# EAGLE design Homematic (EAGLE 7.7.0)
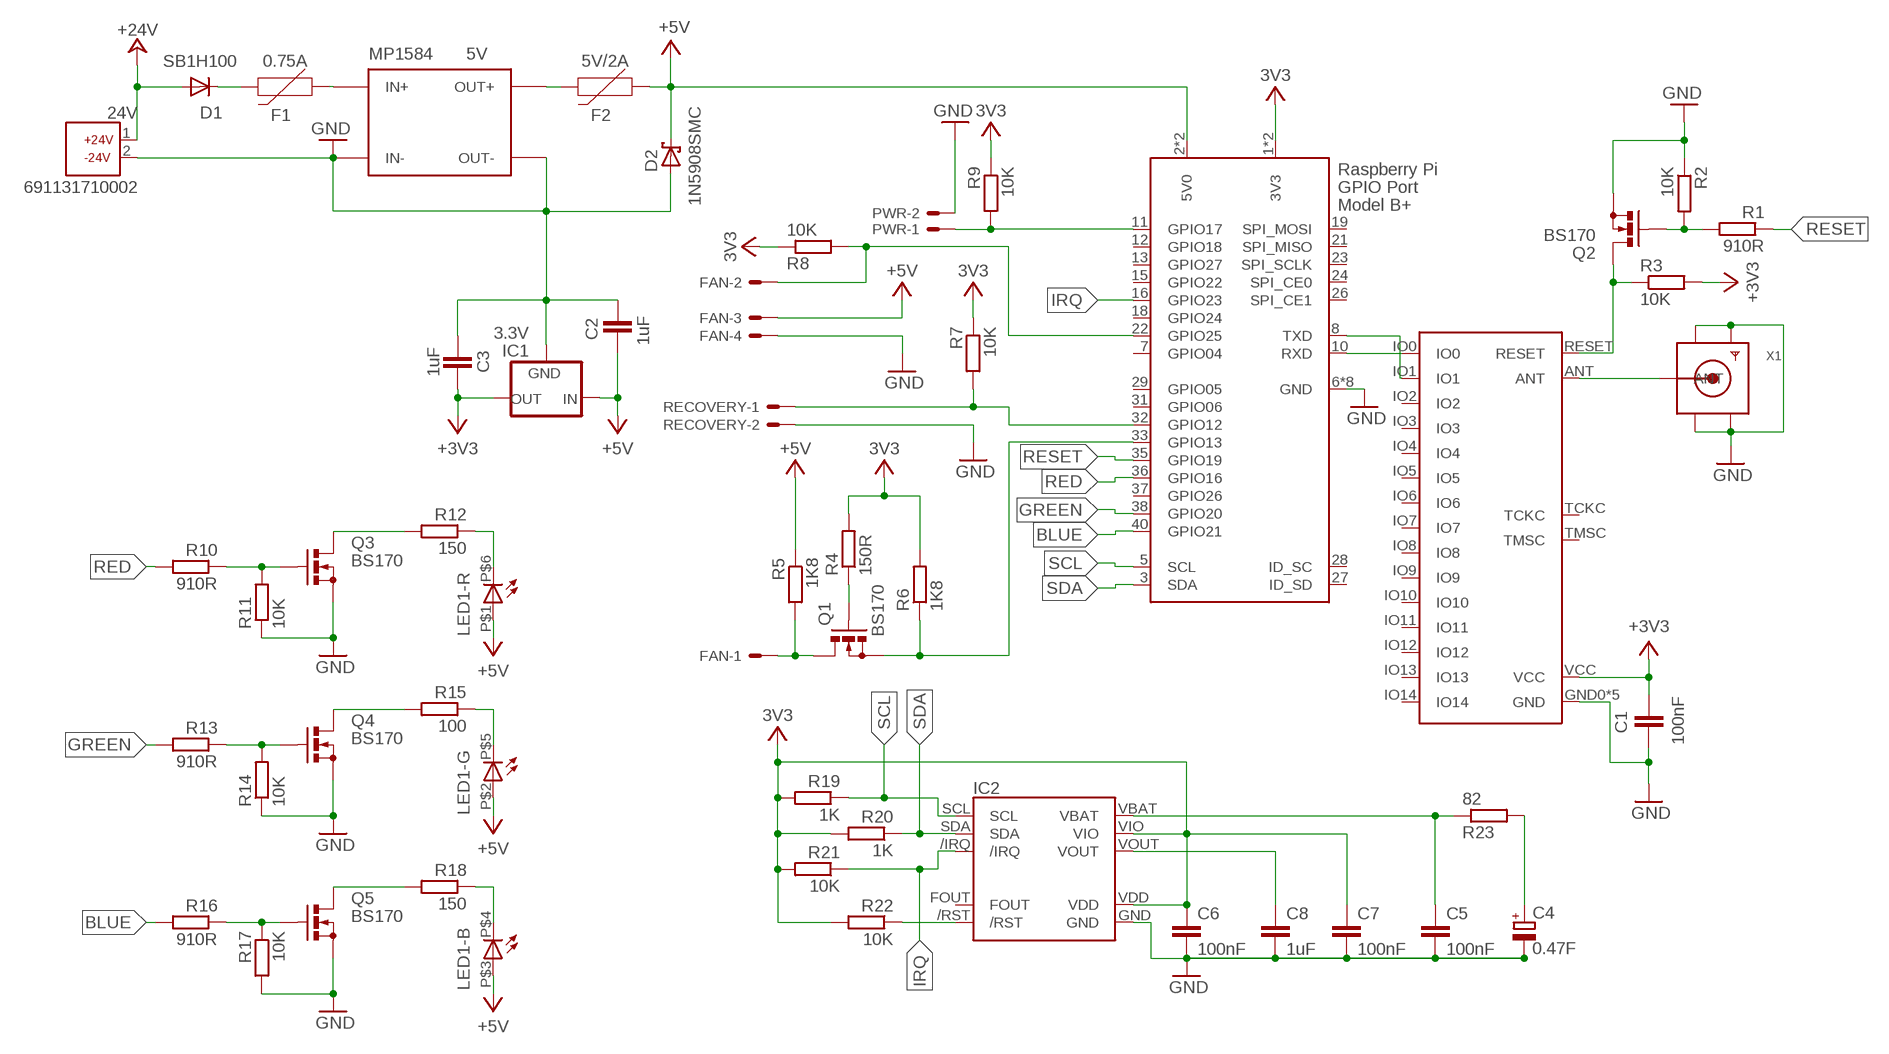
[diagram p0: schematic, sheet 1]

## Parts
24V  691131710002  [691131710002]
C1  100nF  C-EUC0805  [C0805]
C2  1uF  C-EUC0805  [C0805]
C3  1uF  C-EUC0805  [C0805]
C4  0.47F  CPOL-EUV  [GOLDCAP-V]
C5  100nF  C-EUC0805  [C0805]
C6  100nF  C-EUC0805  [C0805]
C7  100nF  C-EUC0805  [C0805]
C8  1uF  C-EUC0805  [C0805]
D1  SB1H100  DIODE-DO41-7.6  [DO41-7.6]
D2  1N5908SMC  [SMC]
F1  0.75A  PPTCRGEF250  [RGEF250]
F2  5V/2A  PPTCRGEF250  [RGEF250]
FAN  22-23-2041  [22-23-2041]
IC1  3.3V  MCP1700TRI  [TO92]
IC2  RX8130SMT  [SMT-3225-10]
LED1  LED-RGB  LED-RGBSMD  [PLCC6]
MP1584  5V  DC-DC-STEP-DOWNMP1584-V  [MP1584V]
PWR  22-23-2021  [22-23-2021]
Q1  BS170  [SOT54E]
Q2  BS170  [SOT54E]
Q3  BS170  [SOT54E]
Q4  BS170  [SOT54E]
Q5  BS170  [SOT54E]
R1  910R  R-EU_0204/5  [0204/5]
R2  10K  R-EU_0204/5  [0204/5]
R3  10K  R-EU_0204/2V  [0204V]
R4  150R  R-EU_0204/2V  [0204V]
R5  1K8  R-EU_0204/2V  [0204V]
R6  1K8  R-EU_0204/2V  [0204V]
R7  10K  R-EU_0204/2V  [0204V]
R8  10K  R-EU_0204/2V  [0204V]
R9  10K  R-EU_0204/2V  [0204V]
R10  910R  R-EU_0204/2V  [0204V]
R11  10K  R-EU_0204/2V  [0204V]
R12  150  R-EU_0204/2V  [0204V]
R13  910R  R-EU_0204/2V  [0204V]
R14  10K  R-EU_0204/2V  [0204V]
R15  100  R-EU_0204/2V  [0204V]
R16  910R  R-EU_0204/2V  [0204V]
R17  10K  R-EU_0204/2V  [0204V]
R18  150  R-EU_0204/2V  [0204V]
R19  1K  R-EU_0204/5  [0204/5]
R20  1K  R-EU_0204/5  [0204/5]
R21  10K  R-EU_0204/5  [0204/5]
R22  10K  R-EU_0204/5  [0204/5]
R23  82  R-EU_0204/5  [0204/5]
RECOVERY  22-23-2021  [22-23-2021]
RPI  RASPI_BOARD_B+#_F  [RASPI_BOARD_B+_FULL]
TRX2-TIF  TRXC2-TIFSMD  [TRXC2-TIF]
X1  SMACONNECTOR  [SMA90_DIP]

## Nets
3V3: C6.1 C7.1 IC2.VDD IC2.VIO R7.1 R8.1 R9.1 R19.2 R20.2 R21.2 R22.2 RPI.1(3V3) RPI.17(3V3)
+3V3: C1.1 C3.1 IC1.3(OUT) R3.2 TRX2-TIF.VCC
+5V: C2.2 D2.C F2.P$1 FAN.3 IC1.2(IN) LED1.P$1(-R:A) LED1.P$2(-G:A) LED1.P$3(-B:A) R5.1 RPI.2(5V0) RPI.4(5V0)
+24V: 24V.1 D1.A
BLUE: R16.2 RPI.40(GPIO21)
GND: 24V.2 C1.2 C2.1 C3.2 C4.- C5.2 C6.2 C7.2 C8.2 D2.A FAN.4 IC1.1(GND) IC2.GND MP1584.IN-0(IN-) MP1584.IN-1(IN-) MP1584.OUT-0(OUT-) MP1584.OUT-1(OUT-) PWR.2 Q2.S Q3.S Q4.S Q5.S R2.1 R11.1 R14.1 R17.2 RECOVERY.2 RPI.6(GND) RPI.9(GND) RPI.14(GND) RPI.20(GND) RPI.25(GND) RPI.30(GND) RPI.34(GND) RPI.39(GND) TRX2-TIF.GND0(GND) TRX2-TIF.GND1(GND) TRX2-TIF.GND2(GND) TRX2-TIF.GND3(GND) TRX2-TIF.GND4(GND) X1.GND1 X1.GND2 X1.GND3 X1.GND4
GREEN: R13.2 RPI.38(GPIO20)
IRQ: IC2./IRQ R21.1 RPI.16(GPIO23)
N$1: Q3.G R10.1 R11.2
N$2: RPI.10(RXD) TRX2-TIF.IO0
N$3: RPI.8(TXD) TRX2-TIF.IO1
N$4: F2.P$2 MP1584.OUT+0(OUT+) MP1584.OUT+1(OUT+)
N$5: Q4.G R13.1 R14.2
N$6: Q3.D R12.2
N$7: F1.P$1 MP1584.IN+0(IN+) MP1584.IN+1(IN+)
N$8: TRX2-TIF.ANT X1.ANTENNA(ANT)
N$9: D1.C F1.P$2
N$10: Q2.G R1.2 R2.2
N$11: Q1.G R4.1
N$12: Q5.G R16.1 R17.1
N$13: Q1.S R6.1 RPI.33(GPIO13)
N$14: FAN.1 Q1.D R5.2
N$15: Q2.D R3.1 TRX2-TIF.RESET
N$16: Q4.D R15.2
N$17: Q5.D R18.2
N$18: LED1.P$6(-R:C) R12.1
N$19: LED1.P$4(-B:C) R18.1
N$20: LED1.P$5(-G:C) R15.1
N$21: PWR.1 R9.2 RPI.11(GPIO17)
N$22: FAN.2 R8.2 RPI.22(GPIO25)
N$23: C4.+ R23.2
N$24: C5.1 IC2.VBAT R23.1
N$25: IC2./RST R22.1
N$26: R7.2 RECOVERY.1 RPI.32(GPIO12)
RED: R10.2 RPI.36(GPIO16)
RESET: R1.1 RPI.35(GPIO19)
SCL: IC2.SCL R19.1 RPI.5(SCL)
SDA: IC2.SDA R20.1 RPI.3(SDA)
V+: R4.2 R6.2 ; supply symbol labelled 3V3
VOUT: C8.1 IC2.VOUT
Unconnected: IC2.FOUT RPI.7(GPIO04) RPI.12(GPIO18) RPI.13(GPIO27) RPI.15(GPIO22) RPI.18(GPIO24) RPI.19(SPI_MOSI) RPI.21(SPI_MISO) RPI.23(SPI_SCLK) RPI.24(SPI_CE0) RPI.26(SPI_CE1) RPI.27(ID_SD) RPI.28(ID_SC) RPI.29(GPIO05) RPI.31(GPIO06) RPI.37(GPIO26) TRX2-TIF.IO2 TRX2-TIF.IO3 TRX2-TIF.IO4 TRX2-TIF.IO5 TRX2-TIF.IO6 TRX2-TIF.IO7 TRX2-TIF.IO8 TRX2-TIF.IO9 TRX2-TIF.IO10 TRX2-TIF.IO11 TRX2-TIF.IO12 TRX2-TIF.IO13 TRX2-TIF.IO14 TRX2-TIF.TCKC TRX2-TIF.TMSC

## Notes on the sheet
- +24V
- -24V

## Library data of the parts
24V = con-wuerth:691131710002: WR-TBL Terminal block - CUU5/2 CUU5/2GR - 2 Pins;=>Code : Con_TBL_Screw_PClamp_5.00_6911317100xx_691131710002 <http://katalog.we-online.de/media/images/eican/Con_TBL_Screw_PClamp_5.00_6911317100xx_pf2.jpg> Details see: http://katalog.we-online.de/em/datasheet/6911317100xx.pdf Created 11/23/2014, Karrer Zheng 2014 (C) Wurth Elektronik
C1-C3 C5-C8 = rcl:C-EU: CAPACITOR, European symbol
C4 = modules:CPOL-EU: POLARIZED CAPACITOR, European symbol
D1 = diode:DIODE-: DIODE
D2 = diode:1N5908: DIODE schottky
F1 F2 = ptc:PPTC: Resettable Fuse PPTC Resettable Fuse. Really a sort of resistor with a polymeric positive temperature coefficient whose resistance increases dramatically with an increase in temperature. When heated by the power passing through the resistance rises causing the current to be limited, protecting the circuit. This is achieved by the transition of the polymer from a crystalline to an amorphous state where the conductive carbon separates breaking the conductive pathways found in the cool crystalline structure. When a PPTC cools back down it resumes conducting letting the circuit turn back on.; PROD_ID: RES-08490; VALUE: 16V/2.5A
FAN = con-molex:22-23-2041: .100" (2.54mm) Center Header - 4 Pin; MF: MOLEX; MPN: 22-23-2041; OC_FARNELL: 1462920; OC_NEWARK: 38C0355
IC1 = mcp:MCP1700: Voltage Regulator Source: https://www.microchip.com/en-us/product/MCP1700
IC2 = modules:RX8130: https://download.epsondevice.com/td/pdf/app/RX8130CE_en.pdf
LED1 = modules:LED-RGB
MP1584 = modules:DC-DC-STEP-DOWN: DC/DC Step-Down Regulator based on MP1584 chip
PWR RECOVERY = con-molex:22-23-2021: .100" (2.54mm) Center Header - 2 Pin; MF: MOLEX; MPN: 22-23-2021; OC_FARNELL: 1462926; OC_NEWARK: 25C3832
Q1-Q5 = transistor-small-signal:BS170: N-CHANNEL MOS FET
R1-R23 = rcl:R-EU_: RESISTOR, European symbol; OC_FARNELL: unknown
RPI = raspberrypi:RASPI_BOARD_B+#: Raspberry Pi GPIO connector with markings for the outer dimensions of the Raspberry Pi board model B+ with different sets of drill holes or mounting pads All pins connected
TRX2-TIF = modules:TRXC2-TIF
X1 = adafruit:SMACONNECTOR: SMA Connector 90° DIP SMA Connector, 50 Ohm (4UConnector: 07259)

## Net classes
0 default: clearance 0.205 mm

## Board
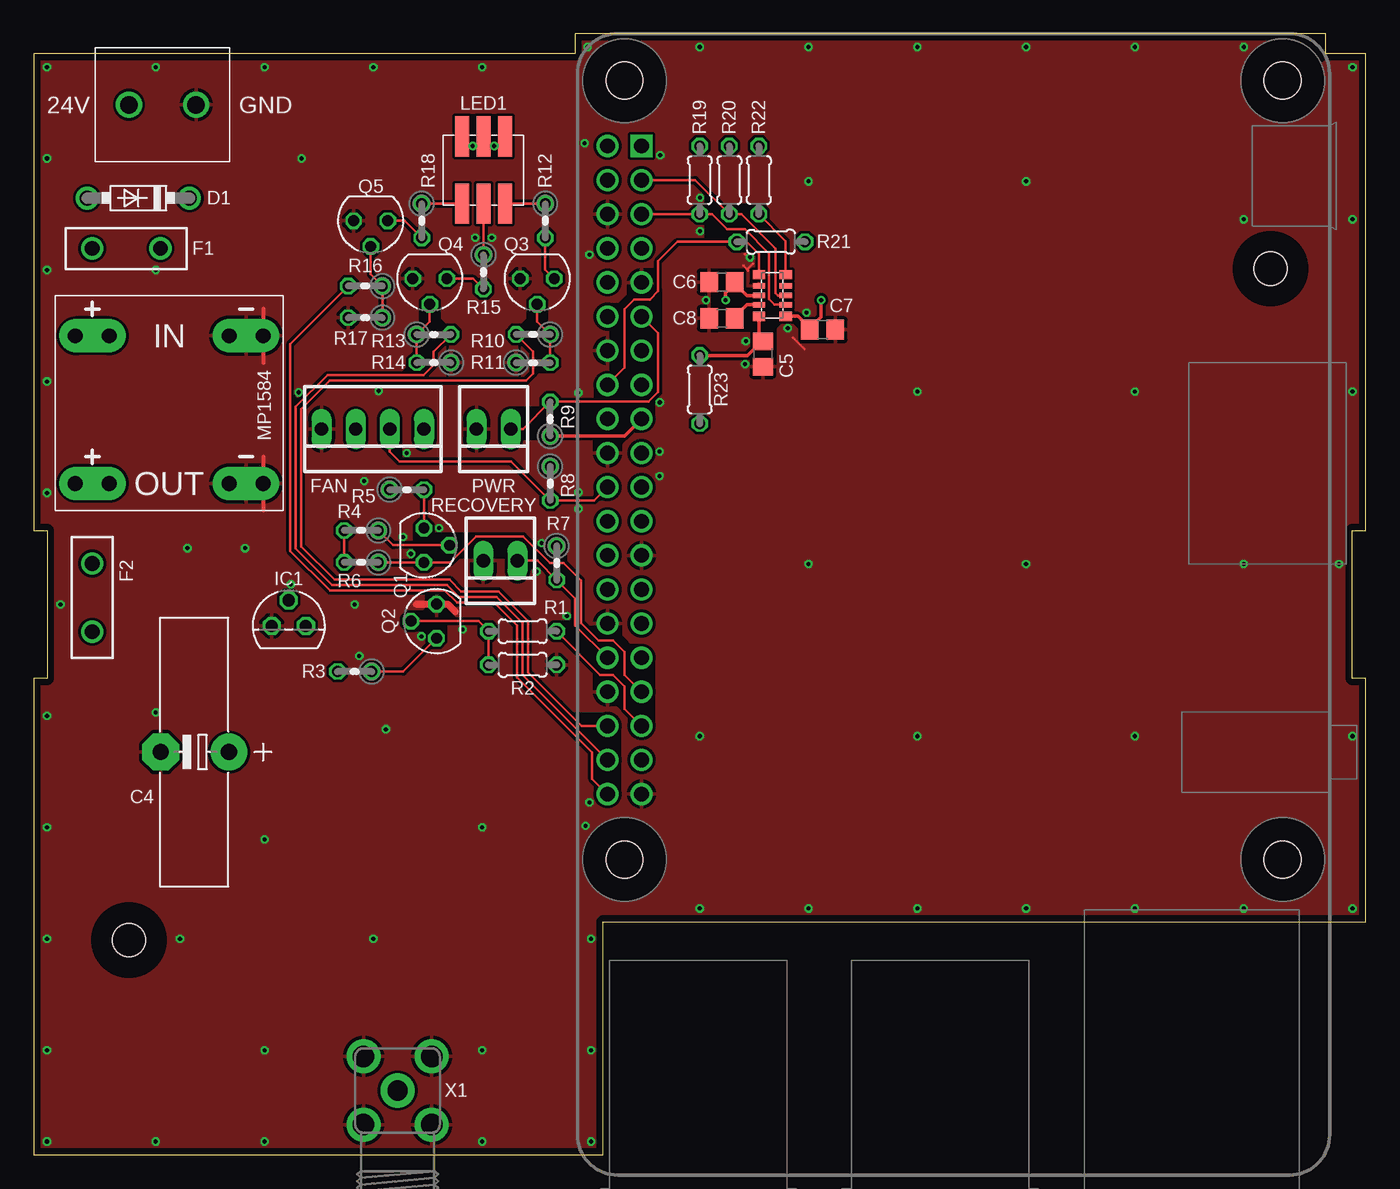
[diagram p1: board, top side]
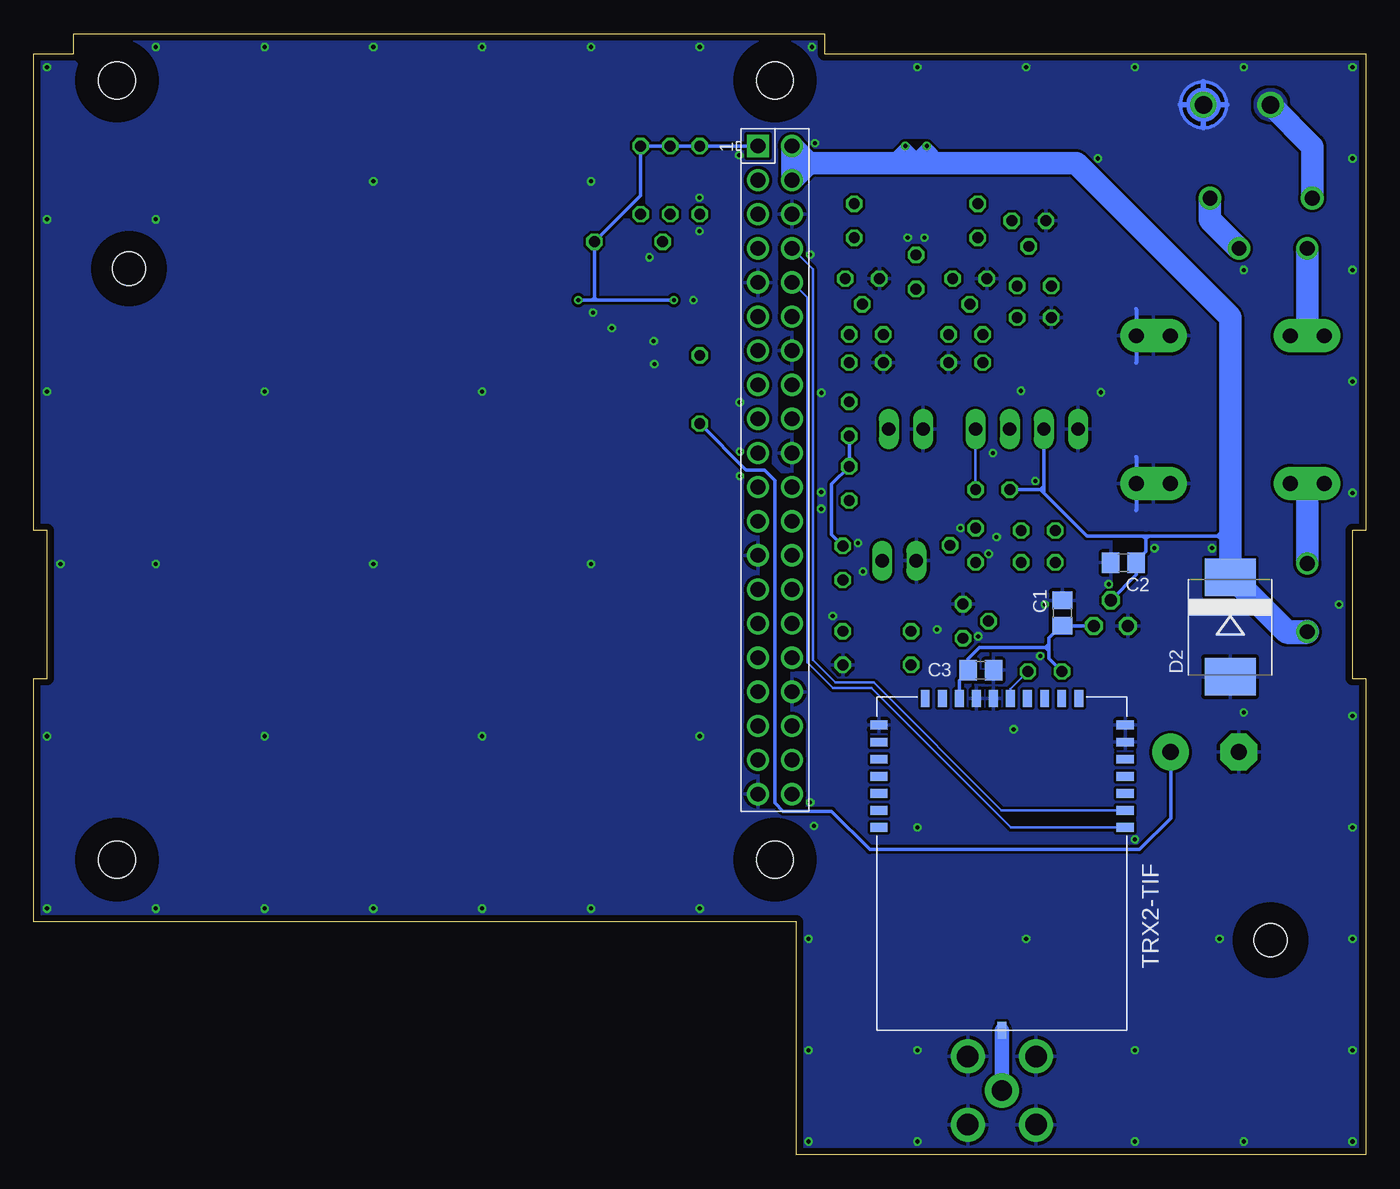
[diagram p2: board, bottom side, seen from below]

Size 99.2 x 83.5 mm. Coordinates in mm from the lower left corner, seen from the top.
Outline: 0,0 42.4,0 42.4,17.35 99.2,17.35 99.2,35.5 98.2,35.5 98.2,46.5 99.2,46.5 99.2,82 96.2,82 96.2,83.5 40.3,83.5 40.3,82 0,82 0,46.5 1,46.5 1,35.5 0,35.5 0,0
Copper layers (1*16): Top 0.035mm / dielectric 1.6mm / Bottom 0.035mm
Design rules "Elecrow *": minimum track width 6mil, minimum drill 12mil, track to track 6mil, track to pad 6mil, pad to pad 12mil, via to via 12mil, smd to smd 0mil, copper to edge 20mil, drill to drill 10mil, minimum pad ring 6mil, minimum via ring 6mil, stop-mask expansion 0mil, vias tented up to drill 100mil, thermal gap 10mil
Holes 2.5 mm at 7.1,16 92.1,66
tRestrict: area 40.9,76.9 to 47.1,83.1; area 89.9,76.9 to 96.1,83.1; area 89.9,18.9 to 96.1,25.1; area 40.9,18.9 to 47.1,25.1; area 89.3,63.2 to 94.9,68.8; area 4.3,13.2 to 9.9,18.8; area 42.9,58 to 44.9,61.5; area 42.9,33.4 to 45.3,35.5; area 41.7,34.6 to 43.8,39.4; area 41.7,52.4 to 43.8,54.5; area 44.2,63.8 to 45.5,64.8; area 45.4,65 to 46.5,66; 4 more areas; 67 lines
bRestrict: area 4.3,13.2 to 9.9,18.8; area 89.3,63.2 to 94.9,68.8; area 40.9,76.9 to 47.1,83.1; area 89.9,76.9 to 96.1,83.1; area 40.9,18.9 to 47.1,25.1; area 89.9,18.9 to 96.1,25.1; area 17,43.1 to 18.8,46.1; area 10.6,76.7 to 13.6,79.7; area 21.6,39.1 to 23.6,41.2; area 41.7,38 to 44.4,41.3; area 28,35.1 to 30,36.1; area 42.9,32.7 to 44.9,36.2; 6 more areas; 34 lines

### Footprints (pad centres in the part's own frame; a part is rotated, then mirrored left to right if it is on the bottom)
691131710002 = drill 1.3: 1 -2.5,0; 2 2.5,0
C0805 = smd 1.3 x 1.5: 1 -0.95,0; 2 0.95,0
GOLDCAP-V = drill 1.2 pad 2.74: + -2.54,0 | drill 1.2 pad 2.74 octagon: - 2.54,0
DO41-7.6 = drill 1.1 pad 1.7: A 3.81,0; C -3.81,0
SMC = smd 2.8 x 3.8: A 3.7,0; C -3.7,0
RGEF250 = drill 1.1: P$1 -2.54,0; P$2 2.54,0
22-23-2041 = drill 1 long: 1 -3.81,0; 2 -1.27,0; 3 1.27,0; 4 3.81,0
TO92 = drill 0.9 octagon: 1 -1.27,0; 2 0,1.905; 3 1.27,0
SMT-3225-10 = smd 0.7 x 0.9: /IRQ 1.55,1; /RST 1.55,-1; VBAT -1.55,1; VIO -1.55,-1 | smd 0.4 x 0.9: FOUT 0.7,-1; GND 0.7,1; SCL -0.7,-1; SDA 0,-1; VDD 0,1; VOUT -0.7,1
PLCC6 = smd 3 x 1.016: P$1 -2.5,1.6; P$2 -2.5,0; P$3 -2.5,-1.6; P$4 2.5,-1.6; P$5 2.5,0; P$6 2.5,1.6
MP1584V = drill 1.1 pad 2.5 offset: IN+0 -2,-4.46; IN-0 -2,4.46; OUT+0 9,-4.46; OUT-0 9,4.46 | drill 1.1: IN+1 -2,-7; IN-1 -2,7; OUT+1 9,-7; OUT-1 9,7
22-23-2021 = drill 1 long: 1 -1.27,0; 2 1.27,0
SOT54E = drill 0.813 octagon: D -1.27,0; G 0,1.905; S 1.27,0
0204/5 = drill 0.813 octagon: 1 -2.54,0; 2 2.54,0
0204V = drill 0.813 octagon: 1 -1.27,0; 2 1.27,0
RASPI_BOARD_B+_FULL = drill 1.1 square: 1 8.37,51.23 | drill 1.1: 2 8.37,53.77; 3 10.91,51.23; 4 10.91,53.77; 5 13.45,51.23; 6 13.45,53.77; 7 15.99,51.23; 8 15.99,53.77; 9 18.53,51.23; 10 18.53,53.77; 11 21.07,51.23; 12 21.07,53.77; 13 23.61,51.23; 14 23.61,53.77; 15 26.15,51.23; 16 26.15,53.77; 17 28.69,51.23; 18 28.69,53.77; 19 31.23,51.23; 20 31.23,53.77; 21 33.77,51.23; 22 33.77,53.77; 23 36.31,51.23; 24 36.31,53.77; 25 38.85,51.23; 26 38.85,53.77; 27 41.39,51.23; 28 41.39,53.77; 29 43.93,51.23; 30 43.93,53.77; 31 46.47,51.23; 32 46.47,53.77; 33 49.01,51.23; 34 49.01,53.77; 35 51.55,51.23; 36 51.55,53.77; 37 54.09,51.23; 38 54.09,53.77; 39 56.63,51.23; 40 56.63,53.77 | hole 2.75: 3.5,3.5; 3.5,52.5; 61.5,3.5; 61.5,52.5
TRXC2-TIF = smd 0.66 x 1.27: ANT 0,12.41; GND2 0.635,-12.281; GND3 1.905,-12.281; IO5 -5.715,-12.281; IO6 -4.445,-12.281; IO7 4.445,-12.281; IO8 5.715,-12.281; RESET -0.635,-12.281; TCKC -3.175,-12.281; TMSC -1.905,-12.281; VCC 3.175,-12.281 | smd 1.27 x 0.66: GND0 -9.171,-9.04; GND1 -9.171,-10.31; GND4 9.171,-10.31; IO0 -9.171,-2.69; IO1 -9.171,-3.96; IO2 -9.171,-5.23; IO3 -9.171,-6.5; IO4 -9.171,-7.77; IO9 9.171,-9.04; IO10 9.171,-7.77; IO11 9.171,-6.5; IO12 9.171,-5.23; IO13 9.171,-3.96; IO14 9.171,-2.69
SMA90_DIP = drill 1.5 pad 2.54: ANTENNA 0,0 | drill 1.6 pad 2.54: GND1 -2.54,2.54; GND2 2.54,2.54; GND3 -2.54,-2.54; GND4 2.54,-2.54

### Placement (x,y rotation side)
24V  9.6,78.2 0 top
C1  22.6,40.35 90 bottom
C2  18.05,44.1 0 bottom
C3  28.67,36.1 0 bottom
C4  12,30 180 top
C5  54.3,59.65 270 top
C6  51.25,65 180 top
C7  58.75,61.45 0 top
C8  51.25,62.3 180 top
D1  7.8,71.25 180 top
D2  10.1,39.31 270 bottom
F1  6.91,67.5 0 top
F2  4.37,41.5 90 top
FAN  25.25,54.05 180 top
IC1  19,39.4 0 top
IC2  55,64 90 top
LED1  33.5,73.33 270 top
MP1584  10.1,59 270 top
PWR  34.25,54.05 180 top
Q1  29.06,45.4 270 top
Q2  30,39.75 90 top
Q3  37.5,65.25 180 top
Q4  29.5,65.25 180 top
Q5  25.1,69.56 180 top
R1  36.41,39 180 top
R2  36.41,36.5 180 top
R3  23.9,36 180 top
R4  24.4,46.5 180 top
R5  27.79,49.54 0 top
R6  24.4,44.13 180 top
R7  38.95,44.08 270 top
R8  38.47,50 270 top
R9  38.47,54.81 90 top
R10  37.2,61.1 180 top
R11  37.2,59 0 top
R12  38.1,69.56 270 top
R13  29.8,61.1 0 top
R14  29.8,59 180 top
R15  33.5,65.75 270 top
R16  24.7,64.7 180 top
R17  24.7,62.35 180 top
R18  28.9,69.56 270 top
R19  49.6,72.59 90 top
R20  51.8,72.59 90 top
R21  54.9,68 0 top
R22  54,72.59 90 top
R23  49.6,57 270 top
RECOVERY  34.75,44.25 180 top
RPI  96.5,83.5 270 bottom
TRX2-TIF  27.1,21.7 180 bottom
X1  27.1,4.8 180 top

### Tracks (layer width: path | path; a pad name or v marks a point on that pad's centre or on a via)
3V3  (via drill 0.3)
  Top 0.203: C6.1 52.2,64.9
  Top 0.254: 52.2,64.9 53.1,64 IC2.VDD | 57.8,61.55 56.9,62.45 IC2.VIO | C6.1 52.2,64.89 51.53,64.22 v51.53,63.65 | 57.8,61.55 C7.1 | v58.64,63.65 58.64,62.39 57.8,61.55 | R9.1 44,53.54 RPI.17
  Bottom 0.254: 57.44,63.85 57.24,63.65 | 57.44,63.85 R21.2 54,71.44 R22.2 R20.2 R19.2 RPI.1 | 57.44,63.85 57.64,63.65 | v58.64,63.65 57.64,63.65 | 57.64,63.65 57.24,63.65 | 57.24,63.65 v51.53,63.65 | R9.1 R8.1 39.79,49.95 39.79,46.19 R7.1
+3V3
  Bottom 0.254: TRX2-TIF.VCC 30.27,35.34 29.62,36 C3.1 29.62,36.95 28.77,37.8 23.86,37.8 | IC1.3 C1.1 22.69,39.4 23.61,38.48 23.61,38.05 | 23.61,37.55 23.61,38.05 | 23.86,37.8 23.61,38.05 | 23.86,37.8 23.61,37.55 | 23.61,37.55 23.61,36.98 R3.2
+5V  (via drill 0.3)
  Top 0.254: LED1.P$3 31.9,75.14 v32.7,75.14 33.5,75.14 | LED1.P$2 33.5,75.14 | 33.5,75.14 v34.3,75.14 35.1,75.14 LED1.P$1
  Bottom 0.203: D2.C 10.1,45.85 10.81,45.85
  Bottom 0.254: 11.06,46.1 10.81,45.85 | 16.63,46.1 16.13,46.1 | 16.13,46.1 11.06,46.1 | 11.06,46.1 10.81,46.35 10.81,45.92 | IC1.2 17.1,43.2 C2.2 17.1,44.2 16.38,44.92 16.38,45.85 | 16.38,45.85 16.13,46.1 | 16.38,45.85 16.63,46.1 | FAN.3 23.98,49.79 | 23.98,49.79 23.98,49.29 | 24.23,49.54 23.98,49.79 | R5.1 24.23,49.54 | 24.23,49.54 23.98,49.29 | 16.63,46.1 20.79,46.1 23.98,49.29
  Bottom 0.61: 33.86,73.97 v32.7,75.14 31.54,73.97 | 33.14,73.97 v34.3,75.14 35.58,73.86 41.46,73.86
  Bottom 1.651: RPI.4 41.46,73.86 RPI.2 RPI.4
  Bottom 1.676: 9.94,43.01 D2.C 10.1,62.39 21.57,73.86 21.86,73.86 22.47,73.86 41.46,73.86
  Bottom 1.778: 9.94,43.01 5.89,38.96 F2.P$1
+24V
  Bottom 1.676: 24V.1 3.99,75.09 D1.A
  pour Bottom (no thermals): 5.96,78.2 arc-180 8.24,78.2 arc-180
BLUE
  Top 0.203: R16.2 19.12,60.39 19.12,44.98 22.07,42.03 30.62,42.03 31.52,41.13 34.3,41.13 35.99,39.44 35.99,35.57 41.59,29.97 41.59,28.01 RPI.40
GND  (via drill 0.3)
  Top 0.203: 57.41,60.01 56.55,60.87 | 53.19,66.84 52.96,67.07 | 53.57,66.35 53.17,65.95 | 53.19,65.86 52.84,66.2
  Top 0.305: 17.1,52 17.1,48 | 17.1,63 17.1,59
  Top 0.504: 28.5,41.02 Q2.S 30.84,41.02 31.39,40.47
  Bottom 0.254: 10.37,78.2 arc-90 12.1,79.92 arc-90 13.82,78.2 arc-90 12.1,76.48 arc-90 10.37,78.2
  Bottom 0.305: 17.1,63 17.1,59 | 17.1,52 17.1,48
  Bottom 0.406: 10.37,78.2 11.1,78.2 24V.2 | 24V.2 13.1,78.2 13.82,78.2 | 12.1,79.92 24V.2 | 24V.2 12.1,76.48
  Bottom 0.54: 11.1,78.2 arc-180 13.1,78.2 arc-180 11.1,78.2
  other vias: 1,1 1,7.8 1,16.1 1,24.4 1,32.7 2,41 1,49.3 1,57.6 1,65.9 1,74.2 1,81 9.1,1 9.1,65.9 9.1,81 10.9,16.1 17.2,81 25.3,16.1 17.2,23.5 25.3,81 33.4,24.4 33.4,81 41.5,1 41.5,7.8 41.5,16.1 41.1,24.5 41.25,82.5 49.6,18.35 49.6,82.5 57.7,18.35 65.8,31.18 57.7,44.01 57.7,82.5 65.8,18.35 65.8,56.84 65.8,82.5 73.9,18.35 82,31.18 73.9,44.01 73.9,82.5 82,18.35 82,56.84 82,82.5 90.1,18.35 90.1,44.01 90.1,69.67 90.1,82.5 98.2,18.35 98.2,31.18 97.2,44.01 98.2,56.84 98.2,69.67 98.2,81 19.96,74.2 31.93,39.13 49.6,31.18 33.4,1 17.2,7.8 24.62,50.18 73.9,72.5 57.7,72.5 46.62,56.04 41.03,75.34 33.4,7.8 40.55,56.75 17.2,1 57.55,62.73 23.91,41 26.23,31.7 9.1,32.95 49.63,68.78 46.66,74.44 41.38,26.26 41.38,67.05 40.56,48.11 49.63,71.28 50.07,63.65 40.56,49.35 25.68,56.9 56.15,61.57 53.03,60.59 46.61,50.56 46.61,52.38 34.12,68.31 32.88,68.31 53.35,66.84 52.98,58.89 19.16,42.49 11.46,45.18 37.83,45.57 28.87,38.62 37.44,43.44 15.74,45.18 39.7,40.12 24.25,37.16 19.74,56.79 28.09,44.77 27.79,52.27 30.18,46.67 27.5,46.02
  pour Bottom (rank 2): 0,83.5 99.2,83.5 99.2,1.5 arc-90 96.2,0 0,0
  pour Top: 0,83.5 99.2,83.5 99.2,0 0,0
GREEN
  Top 0.203: R13.2 29.8,59.83 29.8,58.82 29.05,58.07 21.89,58.07 19.53,55.71 19.53,45.15 22.24,42.44 30.79,42.44 31.68,41.55 34.46,41.55 36.41,39.6 36.41,35.73 RPI.38
IRQ
  Top 0.203: IC2./IRQ 54,67.07 53.07,68 R21.1 47.96,68 46.5,66.54 46.5,64.31 45.89,63.7 44.72,63.7 44,62.98 44,58.62 RPI.16
N$1
  Top 0.203: Q3.G 37.5,62.07 R10.1 R11.2
N$2
  Bottom 0.203: RPI.10 41.59,63.83 41.59,36.67 39.68,34.76 36.81,34.76 26.44,24.39 TRX2-TIF.IO0
N$3
  Bottom 0.203: RPI.8 41.18,65.96 41.18,36.84 39.51,35.17 36.64,35.17 27.13,25.66 TRX2-TIF.IO1
N$4
  Bottom 1.676: MP1584.OUT+0 4.37,50 F2.P$2
N$5
  Top 0.203: Q4.G 29.5,62.07 R13.1 R14.2
N$6
  Top 0.203: R12.2 38.1,65.92 Q3.D
N$7
  Bottom 1.676: MP1584.IN+0 4.37,61 F1.P$1
N$8
  Bottom 1.075: TRX2-TIF.ANT X1.ANTENNA
N$9
  Bottom 1.676: D1.C 11.61,69.66 F1.P$2
N$10
  Top 0.203: Q2.G 33.12,39.75 R1.2 R2.2
N$11
  Top 0.203: Q1.G 26.77,45.4 R4.1
N$12
  Top 0.203: Q5.G 25.1,65.57 R16.1 R17.1
N$13
  Top 0.203: RPI.33 44,35.76 44,37.44 43.14,38.3 42.07,38.3 40.75,39.62 40.75,42.78 39.45,44.08 38.44,44.08 36.46,46.06 32.93,46.06 31,44.13 Q1.S R6.1
N$14
  Top 0.203: Q1.D R5.2
  Bottom 0.203: FAN.1 R5.2
N$15
  Top 0.203: R3.1 27.52,36 Q2.D
  Bottom 0.203: R3.1 26.46,34.7 TRX2-TIF.RESET
N$16
  Top 0.203: R15.2 32.73,65.25 Q4.D
N$17
  Top 0.203: Q5.D 27.63,69.56 R18.2
N$18
  Top 0.203: R12.1 LED1.P$6
N$19
  Top 0.203: R18.1 LED1.P$4
N$20
  Top 0.203: LED1.P$5 R15.1
N$21
  Top 0.203: RPI.11 46.5,61.2 46.5,56.8 45.78,56.08 R9.2 36.44,54.05 PWR.1
N$22
  Top 0.203: RPI.22 41.73,48.73 R8.2 35.55,51.65 27.25,51.65 26.52,52.38 FAN.2
N$23
  Bottom 0.254: C4.+ 14.54,25.08 16.87,22.75 36.93,22.75 39.78,25.6 43.4,25.6 44,26.2 44,50.21 44.79,51 46.14,51 R23.2
N$24
  Top 0.254: R23.1 53.14,59.54 54.2,60.6 C5.1 54.25,60.6 54,60.85 IC2.VBAT
N$25
  Top 0.203: R22.1 56,68.05 IC2./RST
N$26
  Top 0.203: RECOVERY.1 37.51,44.25 R7.2 40.32,41.44 40.32,39.44 RPI.32
RED
  Top 0.203: R10.2 37.2,59.83 37.2,58.18 36.67,57.65 22.05,57.65 19.94,55.54 19.94,45.32 22.41,42.85 30.96,42.85 31.84,41.97 34.62,41.97 36.83,39.76 36.83,35.91 40.79,31.95 RPI.36
RESET
  Top 0.203: RPI.35 44,33.22 44,34.9 43.14,35.76 42.19,35.76 R1.1
SCL
  Top 0.203: IC2.SCL 55.18,63.3 54.76,63.72 54.76,67.13 52.97,68.92 51.63,68.92 50.5,70.05 R19.1 RPI.5
SDA
  Top 0.203: IC2.SDA 55.41,64 55.24,64.17 55.24,67.5 52.69,70.05 R20.1 49.26,72.59 RPI.3
V+
  Top 0.203: R4.2 R6.2
VOUT
  Top 0.254: C8.1 52.2,62.39 53.11,63.3 IC2.VOUT

### Text on the board
tNames: GND
bDocu: Homematic board / V1.0